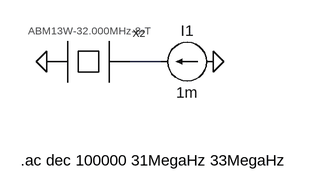
[diagram p0: schematic ABM13W-32.000MHz-8-T AC Sweep.asc]
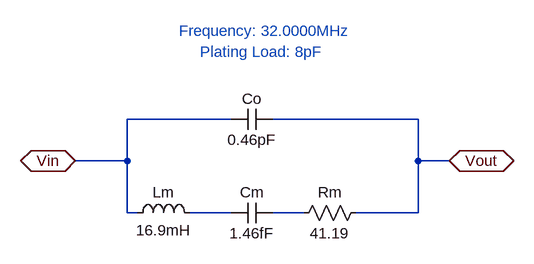
[diagram p1: sub-circuit abm13w-32.000mhz-8-t.asc]
ABM13W-32.000MHz-8-T AC Sweep.asc, the LTspice schematic file:
Version 4
SHEET 1 880 680
WIRE 208 160 160 160
FLAG 288 160 0
FLAG 32 160 0
SYMBOL current 288 160 R90
WINDOW 0 -32 40 VBottom 2
WINDOW 3 32 40 VTop 2
SYMATTR InstName I1
SYMATTR Value 1m
SYMATTR Value2 AC 1
SYMBOL ABM13W-32.000MHz-8-T 96 160 R0
SYMATTR InstName X2
TEXT -8 312 Left 2 !.ac dec 100000 31MegaHz 33MegaHz

abm13w-32.000mhz-8-t.asc, the sub-circuit schematic file:
Version 4
SHEET 1 880 680
WIRE 144 48 -16 48
WIRE 432 48 208 48
WIRE -16 112 -16 48
WIRE -16 112 -96 112
WIRE 432 112 432 48
WIRE 480 112 432 112
WIRE -16 192 -16 112
WIRE 0 192 -16 192
WIRE 144 192 80 192
WIRE 256 192 208 192
WIRE 432 192 432 112
WIRE 432 192 336 192
FLAG -96 112 Vin
IOPIN -96 112 BiDir
FLAG 480 112 Vout
IOPIN 480 112 BiDir
SYMBOL res 352 176 R90
WINDOW 0 0 56 VBottom 2
WINDOW 3 32 56 VTop 2
SYMATTR InstName Rm
SYMATTR Value 41.19
SYMBOL cap 208 176 R90
WINDOW 0 0 32 VBottom 2
WINDOW 3 32 32 VTop 2
SYMATTR InstName Cm
SYMATTR Value 1.46fF
SYMBOL cap 208 32 R90
WINDOW 0 0 32 VBottom 2
WINDOW 3 32 32 VTop 2
SYMATTR InstName Co
SYMATTR Value 0.46pF
SYMBOL ind -16 208 R270
WINDOW 0 32 56 VTop 2
WINDOW 3 5 56 VBottom 2
SYMATTR InstName Lm
SYMATTR Value 16.9mH
TEXT 96 -56 Left 2 ;Plating Load: 8pF
TEXT 64 -88 Left 2 ;Frequency: 32.0000MHz

The netlist it stands for:
* ABM13W-32.000MHz-8-T AC Sweep.asc
I1 0 N001 1m AC 1
XX2 N001 0 abm13w-32.000mhz-8-t

* block symbol definitions
.subckt abm13w-32.000mhz-8-t Vout Vin
Rm Vout N002 41.19
Cm N002 N001 1.46fF
Co Vout Vin 0.46pF
Lm Vin N001 16.9mH
* Plating Load: 8pF
* Frequency: 32.0000MHz
.ends abm13w-32.000mhz-8-t

.ac dec 100000 31MegaHz 33MegaHz
.backanno
.end